# Altium schematic sheet STM32H753.SchDoc
size B; DocumentNumber: 2; SheetNumber: 2; SheetTotal: 9; ENG_APP_DATE: --/--/--; DSN_APP_DATE: --/--/--; CHK_APP_DATE: --/--/--
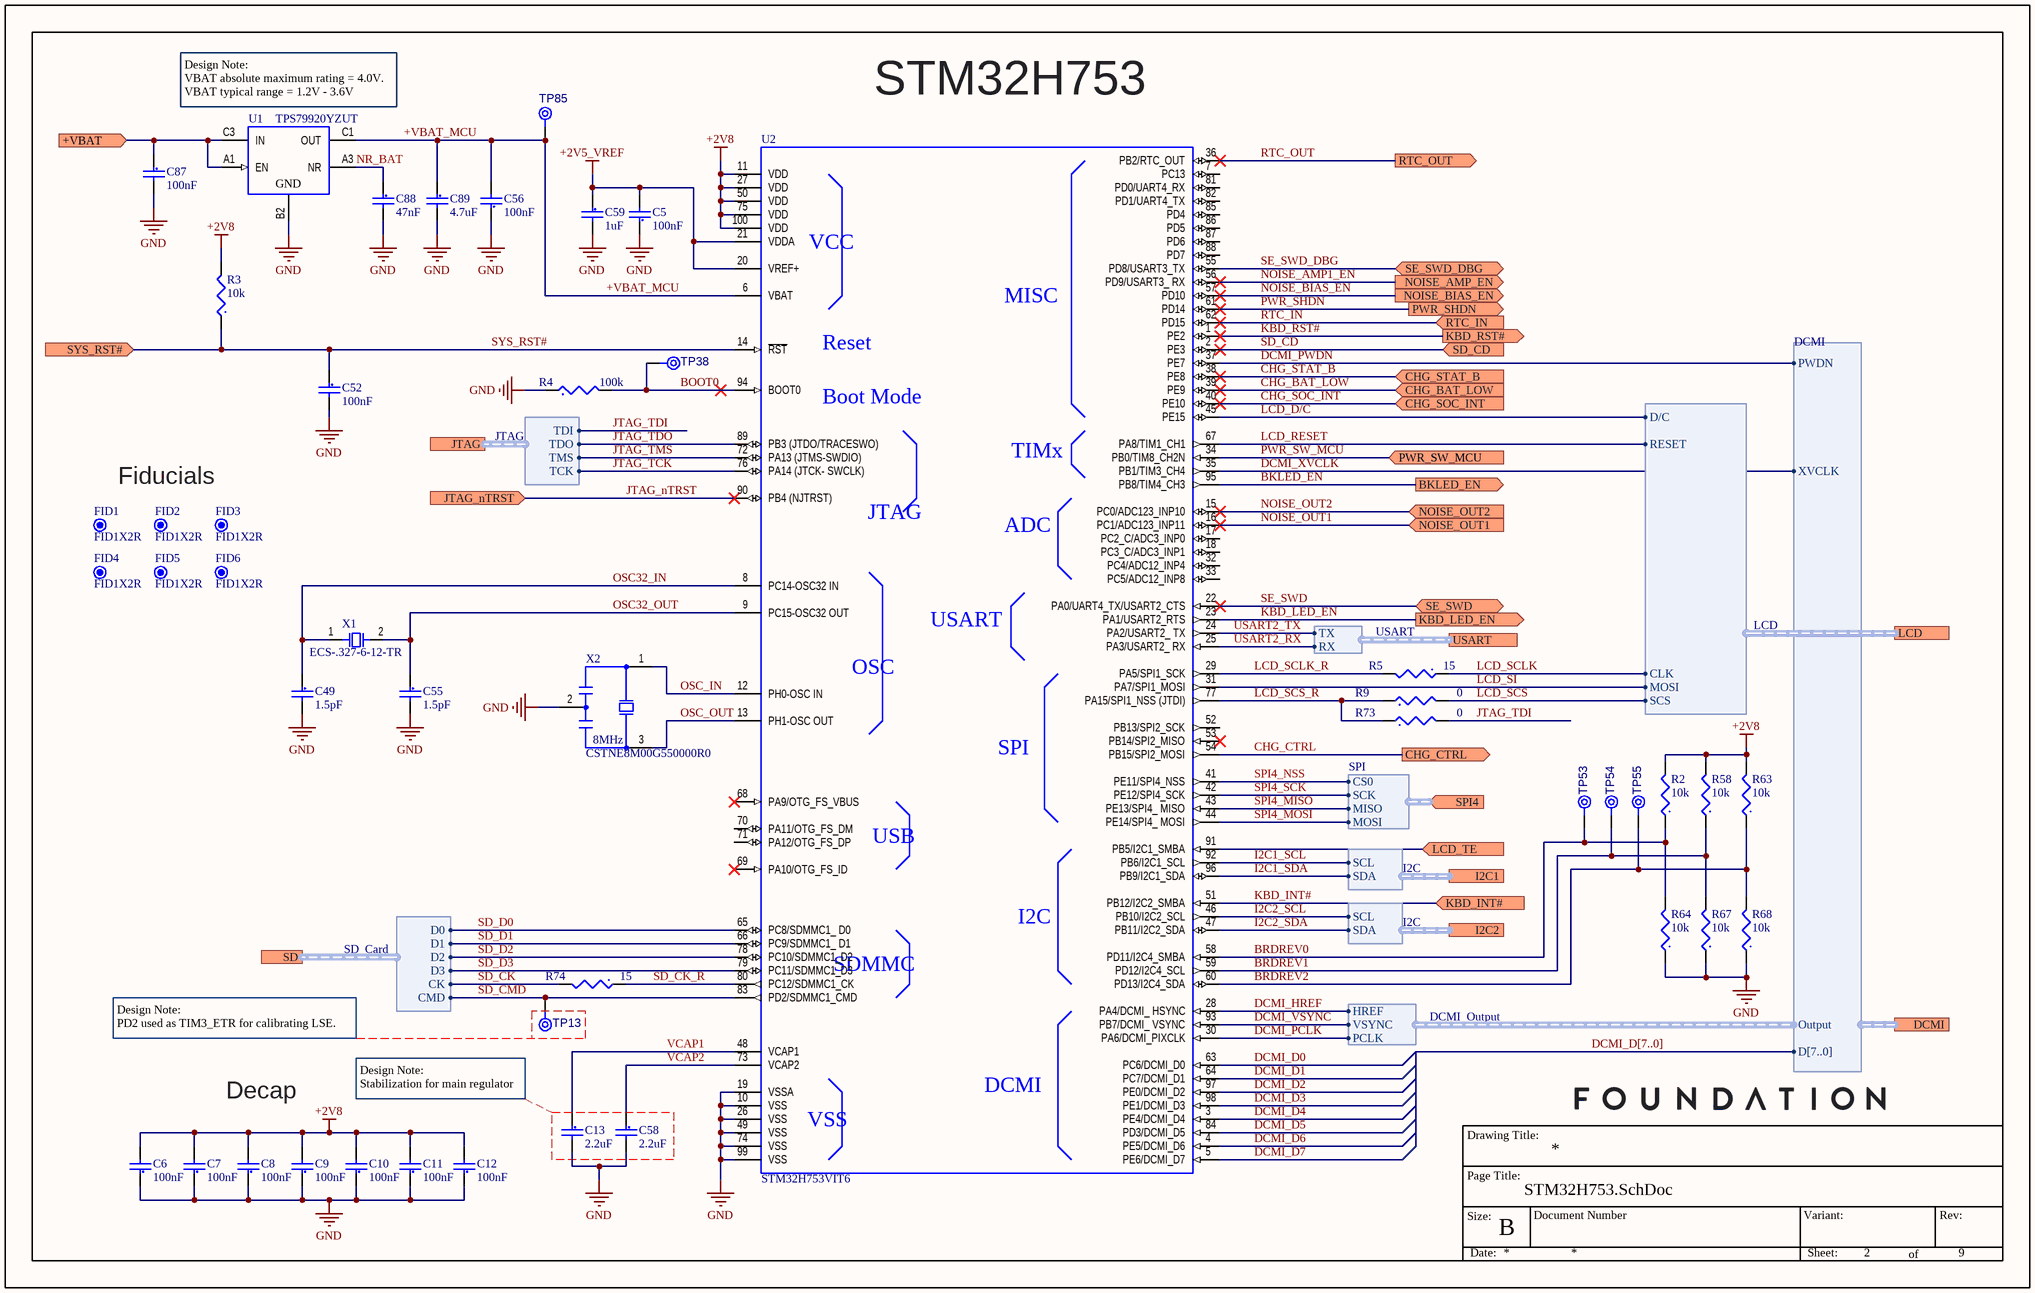
[diagram p0: STM32H753.SchDoc]

## Parts
C5  Capacitance: 100nF  [CAPC0402(1005)55_L]  (hidden comment: CAP CER 0.1uF 16V 10% X7R 0402)
C6  Capacitance: 100nF  [CAPC0402(1005)55_L]  (hidden comment: CAP CER 0.1uF 16V 10% X7R 0402)
C7  Capacitance: 100nF  [CAPC0402(1005)55_L]  (hidden comment: CAP CER 0.1uF 16V 10% X7R 0402)
C8  Capacitance: 100nF  [CAPC0402(1005)55_L]  (hidden comment: CAP CER 0.1uF 16V 10% X7R 0402)
C9  Capacitance: 100nF  [CAPC0402(1005)55_L]  (hidden comment: CAP CER 0.1uF 16V 10% X7R 0402)
C10  Capacitance: 100nF  [CAPC0402(1005)55_L]  (hidden comment: CAP CER 0.1uF 16V 10% X7R 0402)
C11  Capacitance: 100nF  [CAPC0402(1005)55_L]  (hidden comment: CAP CER 0.1uF 16V 10% X7R 0402)
C12  Capacitance: 100nF  [CAPC0402(1005)55_L]  (hidden comment: CAP CER 0.1uF 16V 10% X7R 0402)
C13  Capacitance: 2.2uF  [CAPC0402(1005)55_L]  (hidden comment: CAP CER 2.2uF 6.3V 10% X5R 0402)
C49  Capacitance: 1.5pF  [CAPC0402(1005)55_L]  (hidden comment: CAP CER 1.5pF 50V C0G 0402)
C52  Capacitance: 100nF  [CAPC0402(1005)55_L]  (hidden comment: CAP CER 0.1uF 16V 10% X7R 0402)
C55  Capacitance: 1.5pF  [CAPC0402(1005)55_L]  (hidden comment: CAP CER 1.5pF 50V C0G 0402)
C56  Capacitance: 100nF  [CAPC0402(1005)55_L]  (hidden comment: CAP CER 0.1uF 16V 10% X7R 0402)
C58  Capacitance: 2.2uF  [CAPC0402(1005)55_L]  (hidden comment: CAP CER 2.2uF 6.3V 10% X5R 0402)
C59  Capacitance: 1uF  [CAPC0402(1005)55_L]  (hidden comment: CAP CER 1uF 25V 10% X5R 0402)
C87  Capacitance: 100nF  [CAPC0402(1005)55_L]  (hidden comment: CAP CER 0.1uF 16V 10% X7R 0402)
C88  Capacitance: 47nF  [CAPC0402(1005)55_L]  (hidden comment: CAP CER 0.047uF 10V 10% X7R 0402)
C89  Capacitance: 4.7uF  [CAPC0402(1005)55_L]  (hidden comment: CAP CER 4.7UF 10V 20% X5R 0402)
FID1  FID1X2R  [FID1X2R]  (no BOM)
FID2  FID1X2R  [FID1X2R]  (no BOM)
FID3  FID1X2R  [FID1X2R]  (no BOM)
FID4  FID1X2R  [FID1X2R]  (no BOM)
FID5  FID1X2R  [FID1X2R]  (no BOM)
FID6  FID1X2R  [FID1X2R]  (no BOM)
R2  Resistance: 10k  [RESC0402(1005)_L]  (hidden comment: RES 10K 1/16W 1% 0402)
R3  Resistance: 10k  [RESC0402(1005)_L]  (hidden comment: RES 10K 1/16W 1% 0402)
R4  Resistance: 100k  [RESC0402(1005)_L]  (hidden comment: RES 100K 1/16W 1% 0402)
R5  Resistance: 15  [RESC0402(1005)_L]  (hidden comment: RES 15 OHM 1% 1/16W 0402)
R9  Resistance: 0  [RESC0402(1005)_L]  (hidden comment: RES 0 OHM JUMPER 1/16W 0402)
R58  Resistance: 10k  [RESC0402(1005)_L]  (hidden comment: RES 10K 1/16W 1% 0402)
R63  Resistance: 10k  [RESC0402(1005)_L]  (hidden comment: RES 10K 1/16W 1% 0402)
R64  Resistance: 10k  [RESC0402(1005)_L]  (hidden comment: RES 10K 1/16W 1% 0402)
R67  Resistance: 10k  [RESC0402(1005)_L]  (hidden comment: RES 10K 1/16W 1% 0402)
R68  Resistance: 10k  [RESC0402(1005)_L]  (hidden comment: RES 10K 1/16W 1% 0402)
R73  Resistance: 0  [RESC0402(1005)_L]  (hidden comment: RES 0 OHM JUMPER 1/16W 0402)
R74  Resistance: 15  [RESC0402(1005)_L]  (hidden comment: RES 15 OHM 1% 1/16W 0402)
TP13  TPAD8R  [TP08R]  (value not drawn)  (no BOM)
TP38  TPAD8R  [TP08R]  (value not drawn)  (no BOM)
TP53  TPAD8R  [TP08R]  (value not drawn)  (no BOM)
TP54  TPAD8R  [TP08R]  (value not drawn)  (no BOM)
TP55  TPAD8R  [TP08R]  (value not drawn)  (no BOM)
TP85  TPAD8R  [TP08R]  (value not drawn)  (no BOM)
U1  TPS79920YZUT  [TI - DSBGA-YZU-5_V]
U2  STM32H753VIT6  [STM - LQFP-100_L]
X1  ECS-.327-6-12-TR  [ECS - ECX-12_V]
X2  CSTNE8M00G550000R0  Frequency: 8MHz  [MURA - CSTNE_V]

## Ports
+VBAT (in), BKLED_EN (out), CHG_BAT_LOW (in), CHG_CTRL (out), CHG_SOC_INT (in), CHG_STAT_B (in), DCMI (harness DCMI), I2C1 (harness I2C), I2C2 (harness I2C), JTAG (harness JTAG), JTAG_nTRST (in), KBD_INT# (in), KBD_LED_EN (out), KBD_RST# (out), LCD (harness LCD), LCD_TE (in), NOISE_AMP_EN (out), NOISE_BIAS_EN (out), NOISE_OUT1 (in), NOISE_OUT2 (in), PWR_SHDN (out), PWR_SW_MCU (in), RTC_IN (in), RTC_OUT (out), SD (harness SD_Card), SD_CD (in), SE_SWD (bidir), SE_SWD_DBG (bidir), SPI4 (in, harness SPI), SYS_RST# (in), USART (harness USART)

## Harnesses
LCD: CLK, SCS, MOSI, D/C, RESET
I2C: SCL, SDA
DCMI: Output, D[7..0], PWDN, XVCLK
DCMI_Output: HREF, PCLK, VSYNC
JTAG: TCK, TDI, TDO, TMS
SD_Card: CK, CMD, D0, D1, D2, D3
SPI: CS0, MISO, MOSI, SCK
USART: TX, RX

## Nets
+2V5_VREF: C5.2 C59.1 U2.20(VREF+) U2.21(VDDA)
+2V8: C6.2 C7.2 C8.2 C9.2 C10.2 C11.2 C12.2 R2.2 R3.2 R58.2 R63.2 U2.11(VDD) U2.27(VDD) U2.50(VDD) U2.75(VDD) U2.100(VDD)
GND: C5.1 C6.1 C7.1 C8.1 C9.1 C10.1 C11.1 C12.1 C13.2 C49.2 C52.2 C55.2 C56.1 C58.2 C59.2 C87.2 C88.2 C89.2 R4.1 R64.1 R67.1 R68.1 U1.B2(GND) U2.10(VSS) U2.19(VSSA) U2.26(VSS) U2.49(VSS) U2.74(VSS) U2.99(VSS) X2.2(GND)
+VBAT: C87.1 U1.A1(EN) U1.C3(IN) ; port +VBAT
+VBAT_MCU: C56.2 C89.1 TP85.1(TP) U1.C1(OUT) U2.6(VBAT)
BKLED_EN: U2.95(PB8/TIM4_CH3) ; port BKLED_EN
BOOT0: R4.2 TP38.1(TP) U2.94(BOOT0)
BRDREV0: R2.1 R64.2 TP53.1(TP) U2.58(PD11/I2C4_SMBA)
BRDREV1: R58.1 R67.2 TP54.1(TP) U2.59(PD12/I2C4_SCL)
BRDREV2: R63.1 R68.2 TP55.1(TP) U2.60(PD13/I2C4_SDA)
CHG_BAT_LOW: U2.39(PE9) ; port CHG_BAT_LOW
CHG_CTRL: U2.54(PB15/SPI2_MOSI) ; port CHG_CTRL
CHG_SOC_INT: U2.40(PE10) ; port CHG_SOC_INT
CHG_STAT_B: U2.38(PE8) ; port CHG_STAT_B
DCMI_D0: U2.63(PC6/DCMI_D0)
DCMI_D1: U2.64(PC7/DCMI_D1)
DCMI_D2: U2.97(PE0/DCMI_D2)
DCMI_D3: U2.98(PE1/DCMI_D3)
DCMI_D4: U2.3(PE4/DCMI_D4)
DCMI_D5: U2.84(PD3/DCMI_D5)
DCMI_D6: U2.4(PE5/DCMI_D6)
DCMI_D7: U2.5(PE6/DCMI_D7)
DCMI_HREF: U2.28(PA4/DCMI__HSYNC) ; harness DCMI_Output.HREF
DCMI_PCLK: U2.30(PA6/DCMI_PIXCLK) ; harness DCMI_Output.PCLK
DCMI_PWDN: U2.37(PE7) ; port DCMI.PWDN
DCMI_VSYNC: U2.93(PB7/DCMI__VSYNC) ; harness DCMI_Output.VSYNC
DCMI_XVCLK: U2.35(PB1/TIM3_CH4) ; port DCMI.XVCLK
I2C1_SCL: U2.92(PB6/I2C1_SCL) ; port I2C1.SCL
I2C1_SDA: U2.96(PB9/I2C1_SDA) ; port I2C1.SDA
I2C2_SCL: U2.46(PB10/I2C2_SCL) ; port I2C2.SCL
I2C2_SDA: U2.47(PB11/I2C2_SDA) ; port I2C2.SDA
JTAG_nTRST: U2.90(PB4_(NJTRST)) ; port JTAG_nTRST
JTAG_TCK: U2.76(PA14_(JTCK-_SWCLK)) ; port JTAG.TCK
JTAG_TDI: R73.2 ; port JTAG.TDI
JTAG_TDO: U2.89(PB3_(JTDO/TRACESWO)) ; port JTAG.TDO
JTAG_TMS: U2.72(PA13_(JTMS-SWDIO)) ; port JTAG.TMS
KBD_INT#: U2.51(PB12/I2C2_SMBA) ; port KBD_INT#
KBD_LED_EN: U2.23(PA1/USART2_RTS) ; port KBD_LED_EN
KBD_RST#: U2.1(PE2) ; port KBD_RST#
LCD_D/C: U2.45(PE15) ; port LCD.D/C
LCD_RESET: U2.67(PA8/TIM1_CH1) ; port LCD.RESET
LCD_SCLK: R5.1 ; port LCD.CLK
LCD_SCLK_R: R5.2 U2.29(PA5/SPI1_SCK)
LCD_SCS: R9.2 ; port LCD.SCS
LCD_SCS_R: R9.1 R73.1 U2.77(PA15/SPI1_NSS_(JTDI))
LCD_SI: U2.31(PA7/SPI1_MOSI) ; port LCD.MOSI
LCD_TE: U2.91(PB5/I2C1_SMBA) ; port LCD_TE
NOISE_AMP1_EN: U2.56(PD9/USART3__RX) ; port NOISE_AMP_EN
NOISE_BIAS_EN: U2.57(PD10) ; port NOISE_BIAS_EN
NOISE_OUT1: U2.16(PC1/ADC123_INP11) ; port NOISE_OUT1
NOISE_OUT2: U2.15(PC0/ADC123_INP10) ; port NOISE_OUT2
NR_BAT: C88.1 U1.A3(NR)
OSC32_IN: C49.1 U2.8(PC14-OSC32_IN) X1.1
OSC32_OUT: C55.1 U2.9(PC15-OSC32_OUT) X1.2
OSC_IN: U2.12(PH0-OSC_IN) X2.1
OSC_OUT: U2.13(PH1-OSC_OUT) X2.3
PWR_SHDN: U2.61(PD14) ; port PWR_SHDN
PWR_SW_MCU: U2.34(PB0/TIM8_CH2N) ; port PWR_SW_MCU
RTC_IN: U2.62(PD15) ; port RTC_IN
RTC_OUT: U2.36(PB2/RTC_OUT) ; port RTC_OUT
SD_CD: U2.2(PE3) ; port SD_CD
SD_CK: R74.2 ; port SD.CK
SD_CK_R: R74.1 U2.80(PC12/SDMMC1_CK)
SD_CMD: TP13.1(TP) U2.83(PD2/SDMMC1_CMD) ; port SD.CMD
SD_D0: U2.65(PC8/SDMMC1__D0) ; port SD.D0
SD_D1: U2.66(PC9/SDMMC1__D1) ; port SD.D1
SD_D2: U2.78(PC10/SDMMC1_D2) ; port SD.D2
SD_D3: U2.79(PC11/SDMMC1_D3) ; port SD.D3
SE_SWD: U2.22(PA0/UART4_TX/USART2_CTS) ; port SE_SWD
SE_SWD_DBG: U2.55(PD8/USART3_TX) ; port SE_SWD_DBG
SPI4_MISO: U2.43(PE13/SPI4__MISO) ; port SPI4.MISO
SPI4_MOSI: U2.44(PE14/SPI4__MOSI) ; port SPI4.MOSI
SPI4_NSS: U2.41(PE11/SPI4_NSS) ; port SPI4.CS0
SPI4_SCK: U2.42(PE12/SPI4_SCK) ; port SPI4.SCK
SYS_RST#: C52.1 R3.1 U2.14(~{RST}) ; port SYS_RST#
USART2_RX: U2.25(PA3/USART2__RX) ; port USART.RX
USART2_TX: U2.24(PA2/USART2__TX) ; port USART.TX
VCAP1: C13.1 U2.48(VCAP1)
VCAP2: C58.1 U2.73(VCAP2)

Not connected (* = marked no-connect by the designer): U2 7(PC13) 17(PC2_C/ADC3_INP0) 18(PC3_C/ADC3_INP1) 32(PC4/ADC12_INP4) 33(PC5/ADC12_INP8) 52(PB13/SPI2_SCK) 53(PB14/SPI2_MISO)* 68(PA9/OTG_FS_VBUS)* 69(PA10/OTG_FS_ID)* 70(PA11/OTG_FS_DM) 71(PA12/OTG_FS_DP) 81(PD0/UART4_RX) 82(PD1/UART4_TX) 85(PD4) 86(PD5) 87(PD6) 88(PD7)

## Buses and harness runs
bus DCMI_D[7..0]

## Notes on the sheet
- (near U1) Design Note:
  VBAT absolute maximum rating = 4.0V.
  VBAT typical range = 1.2V - 3.6V
- STM32H753
- Fiducials
- Design Note:
  PD2 used as TIM3_ETR for calibrating LSE.
- Decap
- Design Note:
  Stabilization for main regulator
- Drawing Title:
- Page Title:
- Size:
- B
- Document Number
- Variant:
- Rev:
- Date:
- Sheet:
- of
- (in symbol CMP-IC-CPU-00008-1) VCC; MISC; Reset; Boot Mode; TIMx; JTAG; ADC; USART; OSC; SPI; USB; I2C; SDMMC; DCMI

## Library data of the parts
C5-C12 C52 C56 C87 = CMP-CAP-00002-2: 0.1µF ±10% 16V Ceramic Capacitor X7R 0402 (1005 Metric); Insulation Resistance: 10GR; Material: Ceramic; Tolerance: 10%; REACH SVHC: No SVHC; Radiation Hardening: No; Case Code (Metric): 1005; Height: 0.5mm; Depth: 0.5mm; Min Operating Temperature: -55°C; Max Operating Temperature: 125°C; Lead Free: Lead Free; Thickness: 0.022inch; Length: 1mm; Voltage Rating (DC): 16V; Dielectric Material: Ceramic; Packaging: Tape and Reel; Case/Package: 0402; Width: 0.5mm; Termination: SMD/SMT; Voltage Rating: 16V; Mount: Surface Mount; Case Code (Imperial): 0402; Package Quantity: 1; Dielectric: X7R; Number of Pins: 2; Voltage: 16V
C13 C58 = CMP-CAP-00042-1: 2.2µF ±10% 6.3V Ceramic Capacitor X5R 0402 (1005 Metric); Lead Free: Lead Free; Tolerance: 10%; Width: 0.02inch; Number of Pins: 2; Contact Plating: Tin,Matte; Max Operating Temperature: 85°C; Termination: SMD/SMT; Voltage Rating: 6.3V; Thickness: 0.022inch; Case Code (Imperial): 0402; Case Code (Metric): 1005; Radiation Hardening: No; Package Quantity: 1; Mount: Surface Mount; Length: 1mm; Case/Package: 0402; REACH SVHC: No SVHC; Packaging: Tape and Reel; Min Operating Temperature: -55°C; Dielectric: X5R; Depth: 0.5mm; Voltage Rating (DC): 6.3V
C49 C55 = CMP-CAP-00048-1: 1.5pF ±0.25pF 50V Ceramic Capacitor C0G, NP0 0402 (1005 Metric); Tolerance: 20%; Voltage Rating: 50V; Min Operating Temperature: -55°C; Length: 1mm; Width: 0.02inch; Packaging: Tape and Reel; Mount: Surface Mount; Case/Package: 0402; Max Operating Temperature: 125°C; Termination: SMD/SMT; Height: 0.5mm; Dielectric: C0G; Lead Free: Lead Free; Voltage: 50V; Package Quantity: 1; Voltage Rating (DC): 50V; Case Code (Imperial): 0402; Case Code (Metric): 1005; Thickness: 0.022inch; Radiation Hardening: No; Depth: 0.5mm
C59 = CMP-CAP-00053-2: 1uF ±10% 25V Ceramic Capacitor X5R 0402 (1005 Metric); Number of Terminals/Pins: 2; Multilayer: Yes; Width: 0.5mm; Height: 0.6mm; Termination: Wraparound; Dielectric Material: Ceramic; Min Operating Temperature: -55°C; Mount: Surface Mount; Length: 1mm; Capacitor Type: Ceramic; Max Operating Temperature: 85°C; Packaging: Tape and Reel; Negative Tolerance: 10%; Package Style: SMTMeter; Package Shape: Rectangular; Size Code: 0402; Rated DC Voltage (URdc): 25V; Terminal Finish: Nickel; Positive Tolerance: 10%; JESD-609 Code: e3; Temperature Characteristics Code: X5R
C88 = CMP-CAP-00056-1: 0.047µF ±10% 10V Ceramic Capacitor X7R 0402 (1005 Metric); Number of Terminals/Pins: 2; Multilayer: Yes; Height: 0.5mm; Package Shape: Rectangular; Positive Tolerance: 10%; Max Operating Temperature: 125°C; Termination: Wraparound; Capacitor Type: Ceramic; Width: 0.5mm; Negative Tolerance: 10%; Rated DC Voltage (URdc): 10V; Length: 1mm; Mount: Surface Mount; Size Code: 0402; JESD-609 Code: e3; Temperature Characteristics Code: X7R; Min Operating Temperature: -55°C; Terminal Finish: Nickel; Package Style: SMTMeter; Packaging: Tape and Reel; Dielectric Material: Ceramic
C89 = CMP-CAP-00038-1: 4.7µF ±20% 10V Ceramic Capacitor X5R 0402 (1005 Metric); Lead Free: Lead Free; Tolerance: 20%; Width: 0.02inch; Max Operating Temperature: 85°C; Termination: SMD/SMT; Voltage Rating: 10V; Thickness: 500um; Case Code (Imperial): 0402; Case Code (Metric): 1005; Radiation Hardening: No; Package Quantity: 1; Mount: Surface Mount; Length: 1mm; Case/Package: 0402; REACH SVHC: No SVHC; Packaging: Tape and Reel; Min Operating Temperature: -55°C; Dielectric: X5R; Depth: 0.5mm; Voltage Rating (DC): 10V; Voltage: 10V; Weight: 2.3E-05oz; Composition: Ceramic; Dielectric Material: Ceramic; Height: 0.5mm
FID1-FID6 = CMP-MECH-00000-3: Fiducial - Round 1x2mm; Pins: 0
R2 R3 R58 R63 R64 R67 R68 = CMP-RES-00006-3: 10 kOhms ±1% 0.063W, 1/16W Chip Resistor 0402 (1005 Metric); Voltage Rating (DC): 50V; Power Rating: 63mW; Temperature Coefficient: 100ppm/°C; Case Code (Imperial): 0402; Mount: Surface Mount; Composition: Thick Film; Features: Automotive AEC-Q200; Depth: 0.5mm; Height: 0.35mm; Weight: 2.3E-05oz; Number of Pins: 2; Termination: SMD/SMT; Min Operating Temperature: -55°C; Length: 1mm; Package Quantity: 10; Lead Free: Lead Free; Radiation Hardening: No; Max Operating Temperature: 155°C; Voltage Rating: 50V; Military Standard: Not; Case/Package: 0402; Contact Plating: Tin; Max Power Dissipation: 63mW; Tolerance: 1%; Case Code (Metric): 1005; Number of Terminations: 2; Packaging: Tape and Reel; REACH SVHC: Unknown; Width: 0.02inch
R4 = CMP-RES-00003-3: 100 kOhms ±1% 0.063W, 1/16W Chip Resistor 0402 (1005 Metric) Automotive AEC-Q200 Thick Film; Max Power Dissipation: 63mW; Voltage Rating: 50V; Temperature Coefficient: 100ppm/°C; Max Operating Temperature: 155°C; Weight: 2.3E-05oz; Packaging: Tape and Reel; REACH SVHC: Unknown; Length: 1mm; Features: Automotive AEC-Q200; Depth: 0.5mm; Composition: Thick Film; Case Code (Imperial): 0402; Number of Terminations: 2; Package Quantity: 10000; Min Operating Temperature: -55°C; Number of Pins: 2; Lead Free: Lead Free; Military Standard: Not; Case/Package: 0402; Contact Plating: Tin; Tolerance: 1%; Radiation Hardening: No; Termination: SMD/SMT; Voltage Rating (DC): 50V; Mount: Surface Mount; Power Rating: 63mW; Case Code (Metric): 1005; Width: 0.02inch; Height: 0.35mm
R5 R74 = CMP-RES-00085-1: 15 Ohms ±1% 0.063W, 1/16W Chip Resistor 0402 (1005 Metric); Power: 63mW; Voltage Rating: 50V; Number of Terminals/Pins: 2; RoHS Compliant: Yes; REACH SVHC: Yes; Case/Package: 0402; Tolerance: 1%; Resistor Type: FIXED RESISTOR
R9 R73 = CMP-RES-00014-4: 0 Ohms Jumper 0.063W, 1/16W Chip Resistor 0402 (1005 Metric); Temperature Coefficient: 200ppm/°C; Power Rating: 62.5mW; Max Power Dissipation: 63mW; Tolerance: 5%; Voltage Rating: 50V; Lead Free: Lead Free; Height: 0.016inch; Military Standard: Not; Max Operating Temperature: 155°C; Features: Moisture Resistant; Case/Package: 0402; Contact Plating: Tin,Matte; Composition: Thick Film; Number of Terminations: 2; Case Code (Imperial): 0402; Package Quantity: 1; REACH SVHC: Unknown; Radiation Hardening: No; Case Code (Metric): 1005; Width: 0.02inch; Termination: SMD/SMT; Min Operating Temperature: -55°C; Length: 1mm; Packaging: Tape and Reel; Depth: 0.5mm
TP13 TP38 TP53-TP55 TP85 = CMP-MECH-00011-2: 0.8mm round; Pins: 1
U1 = CMP-PMIC-00064-2: Linear Voltage Regulator IC Positive Fixed 1 Output 2.0V 200mA 5-DSBGA (1x1.37); Min Input Voltage: 2.7V; Output Voltage1-Nom: 2V; Dropout Voltage1-Max: 175mV; Input Voltage Absolute-Max: 7V; Number of Terminals/Pins: 5; Number of Functions: 1; Voltage Tolerance-Max: 2%; Output Voltage1-Max: 2.04V; Max Input Voltage: 6.5V; Regulator Type: FIXED POSITIVE SINGLE OUTPUT LDO REGULATOR; Qualification Status: Not Qualified; Output Voltage1-Min: 1.96V; Dropout Voltage1-Nom: 100mV; Technology: BICMOS; Terminal Position: BOTTOM; Height - Seated (Max): 0.625mm; Width: 1.195mm; Terminal Finish: Copper; Package Code: VFBGA; JESD-609 Code: e1; ComponentLink1Description: Datasheet; Package Style: GRID ARRAY, VERY THIN PROFILE, FINE PITCHMeter; Operating Temperature, TJ-Max: 125°C; RoHS Compliant: Yes; Terminal Form: Ball; REACH SVHC: Yes; Output Current1-Max: 200mA; Packaging: Tape and Reel; Surface Mount: Yes; Number of Outputs: 1; ComponentLink1URL: https://www.ti.com/lit/ds/sbvs056k/sbvs056k.pdf; Moisture Sensitivity Level: 1; Adjustability: FIXED; Length: 1.53mm; Package Shape: Rectangular; Operating Temperature, TJ-Min: -40°C; Terminal Pitch: 0.5mm; Peak Reflow Temperature (Cel): 260°C
U2 = CMP-IC-CPU-00008-1: ARM® Cortex®-M7 STM32H7 Microcontroller IC 32-Bit 480MHz 2MB (2M x 8) FLASH 100-LQFP (14x14); Max Supply Voltage: 3.6V; RAM Size: 1MB; Number of I/Os: 82; Interface: I2C,SPI,USB,CAN,SDIO,USART; Min Supply Voltage: 1.71V; Core Architecture: ARM; Max Frequency: 400MHz; Data Bus Width: 32b; Number of ADC Channels: 20; Case/Package: LQFP; Min Operating Temperature: -40°C; Memory Type: FLASH; Memory Size: 2MB; Max Operating Temperature: 85°C; ComponentLink1URL: https://www.st.com/content/ccc/resource/technical/document/datasheet/group3/01/21/00/39/12/c9/4c/f1/DM00388325/files/DM00388325.pdf/jcr:content/translations/en.DM00388325.pdf; ComponentLink2Description: Reference Manual; ComponentLink1Description: Datasheet; ComponentLink3Description: Errata; ComponentLink3URL: https://www.st.com/resource/en/errata_sheet/dm00399555-stm32h750xb-and-stm32h753xi-device-limitations-stmicroelectronics.pdf; ComponentLink2URL: https://www.st.com/resource/en/reference_manual/dm00314099-stm32h742-stm32h743-753-and-stm32h750-value-line-advanced-arm-based-32-bit-mcus-stmicroelectronics.pdf; Package Quantity: 540
X1 = CMP-XTAL-0006-1: Parallel - Fundamental Quartz Crystal, 0.032768MHz Nom; Load Capacitance: 6pF; Frequency: 32.768kHz; Aging: 3 PPM/FIRST YEAR; Frequency Tolerance: 20ppm; Drive Level: 0.5uW; Series Resistance: 90kR; Frequency Stability: 0.0144%; Min Operating Temperature: -40°C; RoHS Compliant: Yes; Case/Package: SMD/SMT; Max Operating Temperature: 85°C; Operating Frequency-Nom: 0.032768; ComponentLink1Description: Datasheet; Terminal Finish: Gold; ComponentLink1URL: https://ecsxtal.com/store/pdf/ECX_12.pdf; REACH SVHC: Yes; Crystal/Resonator Type: PARALLEL - FUNDAMENTAL; Mount: Surface Mount; JESD-609 Code: e4
X2 = CMP-003-00030-6: 8MHz Ceramic Resonator Built in Capacitor 33pF ±0.2% 40 Ohms -40°C ~ 85°C Surface Mount; Frequency Tolerance: 0.5%; Impedance: 40R; ComponentLink1Description: Datasheet; Max Operating Temperature: 85°C; Packaging: Tape and Reel; Capacitance: 33pF; Mount: Surface Mount; Composition: Ceramic; Min Operating Temperature: -40°C; Frequency Stability: 0.2%; Case/Package: SMD/SMT; ComponentLink1URL: https://www.murata.com/en/products/productdata/8801161740318/SPEC-CSTNE8M00G550000R0.pdf?src-supplier=Digi-Key